# EAGLE design Board2 (1) (EAGLE 8.4.3)
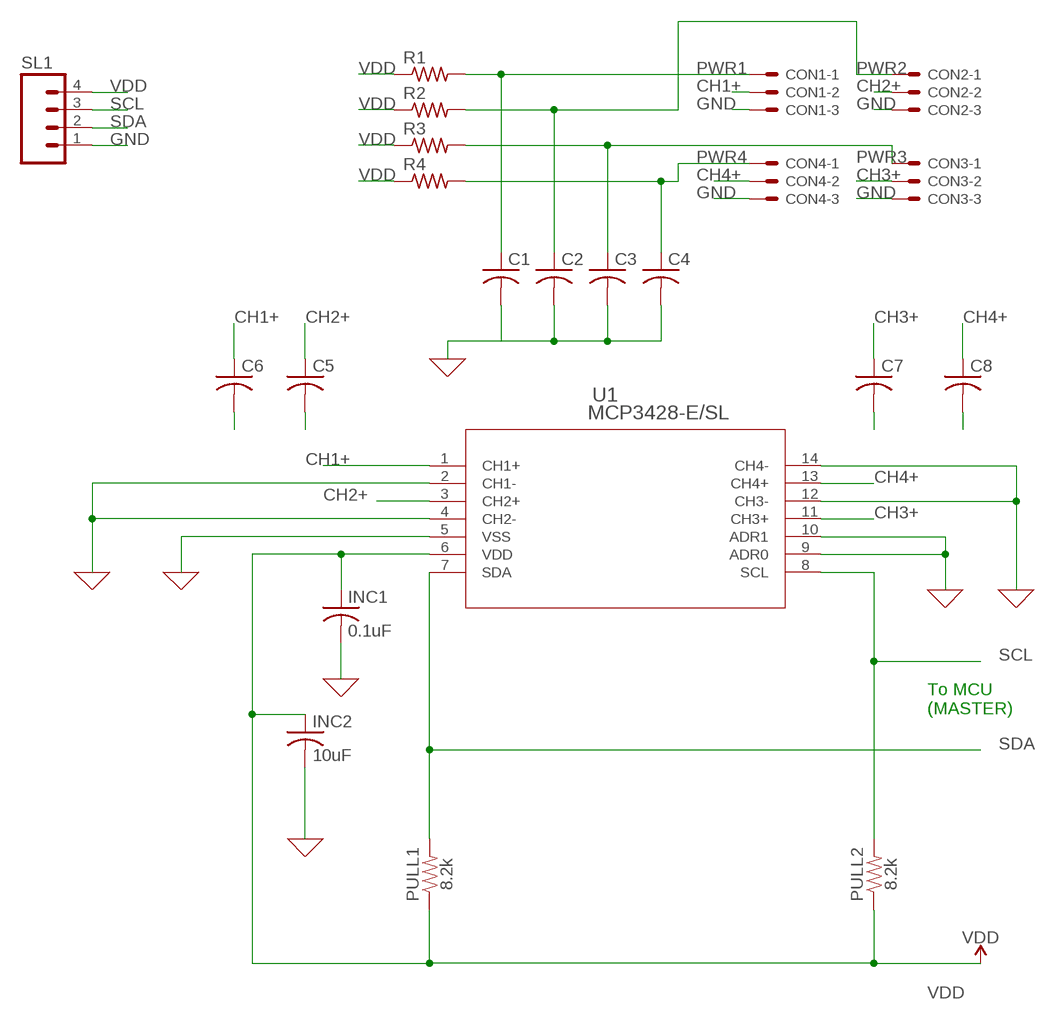
[diagram p0: schematic, sheet 1]

## Parts
C1  C-USC0805  [C0805]
C2  C-USC0805  [C0805]
C3  C-USC0805  [C0805]
C4  C-USC0805  [C0805]
C5  C-USC0805  [C0805]
C6  C-USC0805  [C0805]
C7  C-USC0805  [C0805]
C8  C-USC0805  [C0805]
CON1  KK-156-3  [KK-156-3]
CON2  KK-156-3  [KK-156-3]
CON3  KK-156-3  [KK-156-3]
CON4  KK-156-3  [KK-156-3]
INC1  0.1uF  C-USC0805K  [C0805K]
INC2  10uF  C-USC0805K  [C0805K]
PULL1  8.2k  8.2KOHM-0603-1/10W-5%  [0603]
PULL2  8.2k  8.2KOHM-0603-1/10W-5%  [0603]
R1  R-US_R0805  [R0805]
R2  R-US_R0805  [R0805]
R3  R-US_R0805  [R0805]
R4  R-US_R0805  [R0805]
SL1  MA04  [04PA]
U1  MCP3428-E/SL  [SOIC14-N_MC]

## Nets
CH1+: C6.1 CON1.2 U1.1(CH1+)
CH2+: C5.1 CON2.2 U1.3(CH2+)
CH3+: C7.1 CON3.2 U1.11(CH3+)
CH4+: C8.1 CON4.2 U1.13(CH4+)
GND: C1.2 C2.2 C3.2 C4.2 C5.2 C6.2 C7.2 C8.2 CON1.3 CON2.3 CON3.3 CON4.3 INC1.2 INC2.2 SL1.1 U1.2(CH1-) U1.4(CH2-) U1.5(VSS) U1.9(ADR0) U1.10(ADR1) U1.12(CH3-) U1.14(CH4-)
PWR1: C1.1 CON1.1 R1.2
PWR2: C2.1 CON2.1 R2.2
PWR3: C3.1 CON3.1 R3.2
PWR4: C4.1 CON4.1 R4.2
SCL: PULL2.2 SL1.3 U1.8(SCL)
SDA: PULL1.2 SL1.2 U1.7(SDA)
VDD: INC1.1 INC2.1 PULL1.1 PULL2.1 R1.1 R2.1 R3.1 R4.1 SL1.4 U1.6(VDD)

## Notes on the sheet
- To MCU
  (MASTER)

## Library data of the parts
C1-C8 INC1 INC2 = rcl:C-US: CAPACITOR, American symbol
CON1-CON4 = con-molex:KK-156-3: KK 156 HEADER Source: http://www.molex.com/pdm_docs/sd/026604100_sd.pdf; OC_FARNELL: unknown; OC_NEWARK: unknown
PULL1 PULL2 = SparkFun-Resistors:8.2KOHM: 8.2kΩ resistor A resistor is a passive two-terminal electrical component that implements electrical resistance as a circuit element. Resistors act to reduce current flow, and, at the same time, act to lower voltage levels within circuits. - Wikipedia; PROD_ID: RES-10646
R1-R4 = rcl:R-US_: RESISTOR, American symbol
SL1 = con-amp-quick:MA04: AMP QUICK CONNECTOR; OC_FARNELL: unknown; OC_NEWARK: unknown
U1 = MCP3428:MCP3428-E/SL; MANUFACTURER_PART_NUMBER: MCP3428ESL; VENDOR: Microchip

## Board
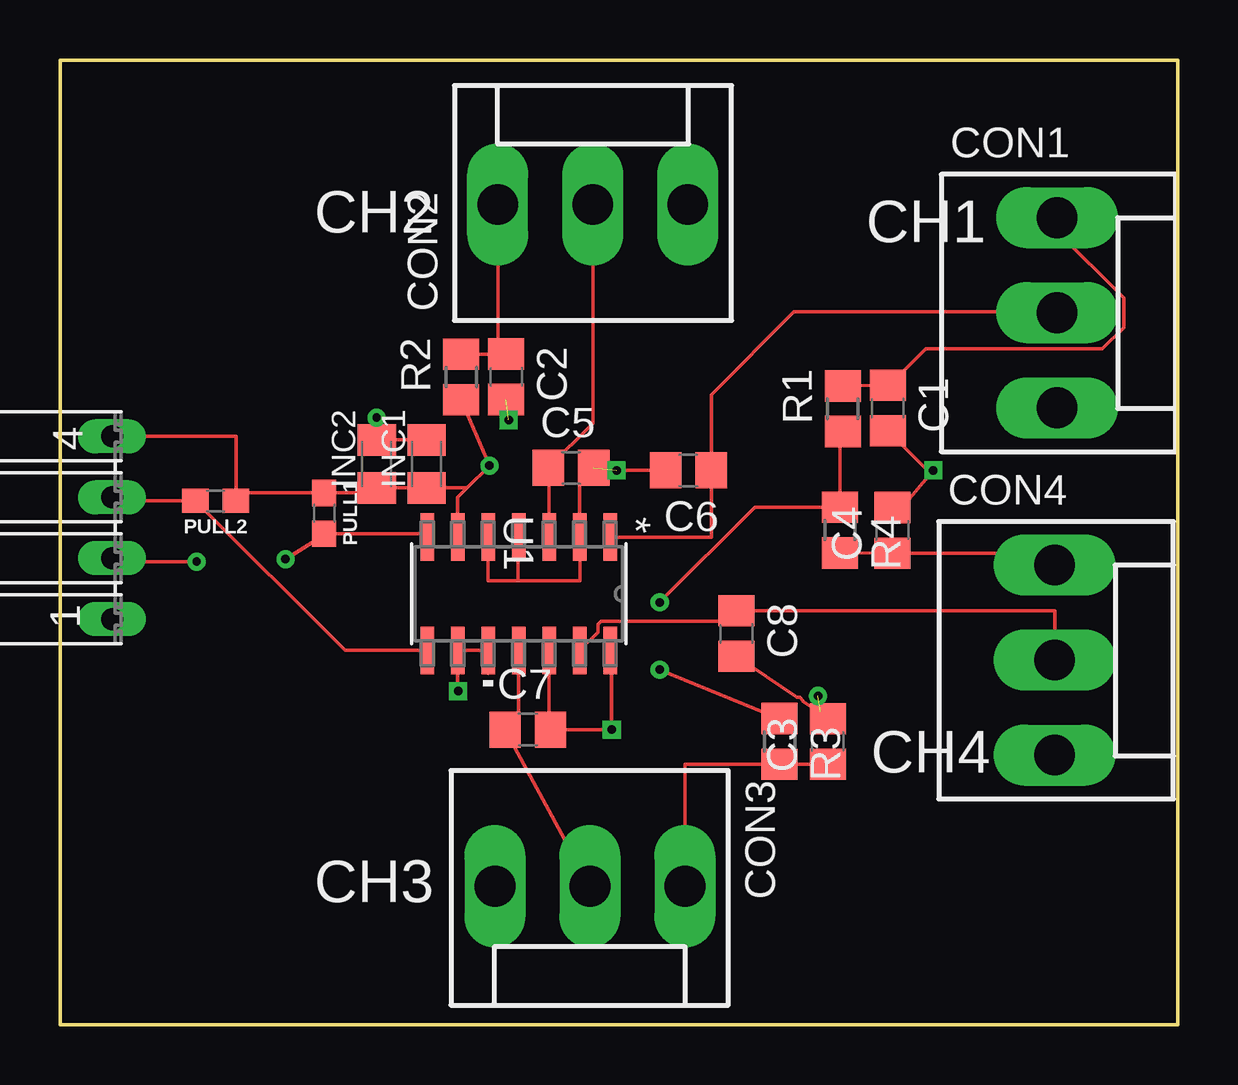
[diagram p1: board, top side]
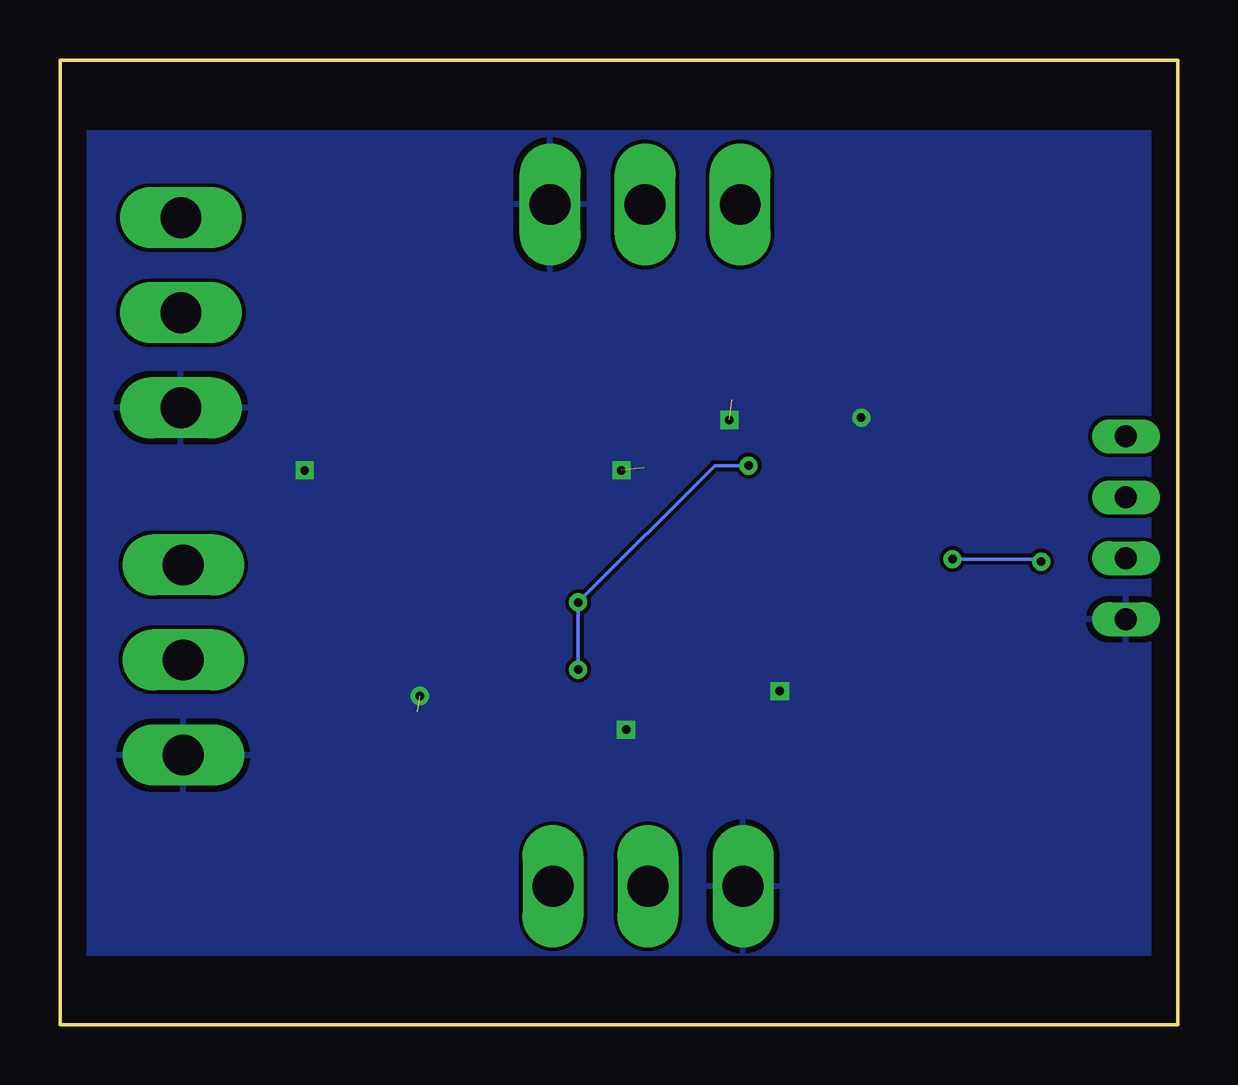
[diagram p2: board, bottom side, seen from below]

Size 46.6 x 40.2 mm. Coordinates in mm from the lower left corner, seen from the top.
Outline: 0,40.2 46.6,40.2 46.6,0 0,0 0,40.2
Copper layers (1*16): Top 0.035mm / dielectric 1.5mm / Bottom 0.035mm
Design rules "default *": minimum track width 6mil, minimum drill 0.35mm, track to track 6mil, track to pad 6mil, pad to pad 6mil, via to via 6mil, smd to smd 6mil, copper to edge 40mil, drill to drill 6mil, minimum pad ring 10mil, minimum via ring 8mil, stop-mask expansion 4mil, vias tented up to drill 0mil, thermal gap 10mil

### Footprints (pad centres in the part's own frame; a part is rotated, then mirrored left to right if it is on the bottom)
C0805 = smd 1.3 x 1.5: 1 -0.95,0; 2 0.95,0
KK-156-3 = drill 1.7 pad 2.184 long: 1 -3.96,0; 2 0,0; 3 3.96,0
C0805K = smd 1.3 x 1.6: 1 -1,0; 2 1,0
0603 = smd 1.1 x 1: 1 -0.85,0; 2 0.85,0
R0805 = smd 1.3 x 1.5: 1 -0.95,0; 2 0.95,0
04PA = drill 0.914 long: 1 -3.81,0; 2 -1.27,0; 3 1.27,0; 4 3.81,0
SOIC14-N_MC = smd 1.981 x 0.559: 1 -2.362,3.81; 2 -2.362,2.54; 3 -2.362,1.27; 4 -2.362,0; 5 -2.362,-1.27; 6 -2.362,-2.54; 7 -2.362,-3.81; 8 2.362,-3.81; 9 2.362,-2.54; 10 2.362,-1.27; 11 2.362,0; 12 2.362,1.27; 13 2.362,2.54; 14 2.362,3.81

### Placement (x,y rotation side)
C1  34.5,25.7 270 top
C2  18.6,27 270 top
C3  32,11.8 90 top
C4  34.7,20.6 90 top
C5  21.3,23.2 0 top
C6  26.2,23.1 180 top
C7  19.5,12.3 0 top
C8  28.2,16.3 270 top
CON1  41.56,29.67 270 top
CON2  22.21,34.18 0 top
CON3  22.09,5.77 180 top
CON4  41.46,15.2 270 top
INC1  15.28,23.37 90 top
INC2  13.2,23.37 90 top
PULL1  11.02,21.31 270 top
PULL2  6.49,21.84 180 top
R1  32.63,25.67 90 top
R2  16.72,26.99 90 top
R3  29.99,11.81 270 top
R4  32.51,20.61 270 top
SL1  2.17,20.71 90 top
U1  19.12,17.96 270 top

### Tracks (layer width: path | path; a pad name or v marks a point on that pad's centre or on a via)
CH1+
  Top 0.152: U1.1 27.15,20.32 C6.1 27.15,26.25 30.6,29.7 41.53,29.7 CON1.2
CH2+
  Top 0.152: U1.3 20.39,23.16 C5.1 22.21,25.06 CON2.2
CH3+
  Top 0.152: U1.11 19.12,12.87 C7.1 CON3.2
CH4+
  Top 0.152: CON4.2 41.46,17.25 C8.1 27.77,16.82 22.56,16.82 22.42,16.68 22.42,16.36 U1.13
GND  (via drill 0.35)  (3 unrouted)
  Top 0.152: INC1.2 INC2.2 v13.2,25.3 | 19.1,18.5 21.68,18.5 U1.2 21.66,22.61 C5.2 | 19.1,18.5 arc-90 19.1,18.5 | 19.1,18.5 19.1,20.3 arc-90 U1.4 | 19.1,18.5 17.85,18.5 U1.5 | 31.93,12.83 31.7,13.05 | 31.93,12.83 C3.2 | C6.2 v23.2,23.1 | C4.2 35.1,21.55 v36.4,23.1 36.15,23.1 C1.2 | v23,12.3 23,12.58 | 20.45,12.4 C7.2 v23,12.3 | 20.45,12.4 20.45,12.95 | 17.85,14.65 U1.10 U1.9 16.58,13.9 v16.6,13.9 | U1.12 20.39,12.46 20.45,12.4 | U1.14 23,15.53 v23,12.3 | C8.2 30.72,13.64 30.83,13.64 30.97,13.51 30.97,13.47 31.93,12.83
  other vias: 31.6,13.7 18.7,25.2
  pour Bottom: -4.18,35.95 -4.18,5.47 -1.64,2.93 51.7,2.93 52.97,4.2 52.97,37.22 -4.18,37.22
PWR1
  Top 0.152: R1.2 C1.1 34.58,26.65 36.1,28.17 43.46,28.17 44.34,29.05 44.34,30.29 41.56,33.07 CON1.1
PWR2
  Top 0.152: R2.2 C2.1 arc90 C2.1 arc-90 18.25,28.3 CON2.1
PWR3
  Top 0.152: CON3.1 26.05,10.86 R3.2 C3.1 arc-90 C3.1
PWR4
  Top 0.152: R4.2 C4.1 41.46,19.65 CON4.1
SCL
  Top 0.152: SL1.3 2.17,21.84 PULL2.2 11.88,15.6 U1.8
SDA  (via drill 0.35)
  Top 0.152: U1.7 15.31,20.46 11.1,20.46 | SL1.2 2.31,19.3 v5.7,19.3 | 11.1,20.46 PULL1.2 | v9.4,19.4 11.1,20.46
  Bottom 0.152: v5.7,19.3 5.8,19.4 v9.4,19.4
VDD  (via drill 0.35)
  Top 0.152: 13.3,22.37 INC2.1 | INC1.1 13.3,22.37 | R4.1 32.12,21.7 32.12,21.72 32.12,21.6 | INC1.1 14.59,21.8 | 25.3,17.6 v25,17.6 28.96,21.56 R4.1 | R4.1 32.51,24.72 R1.1 | SL1.4 7.34,24.52 PULL2.1 7.66,22.16 PULL1.1 13.09,22.16 arc90 13.3,22.37 | U1.6 16.58,21.98 16.97,22.37 | 16.97,22.37 v17.9,23.3 R2.1 | 16.97,22.37 INC1.1 | v25,14.8 R3.1
  Bottom 0.152: v25,14.8 v25,17.6 19.3,23.3 v17.9,23.3

### Text on the board
tSilk: CH2 | CH1 | CH4 | CH3